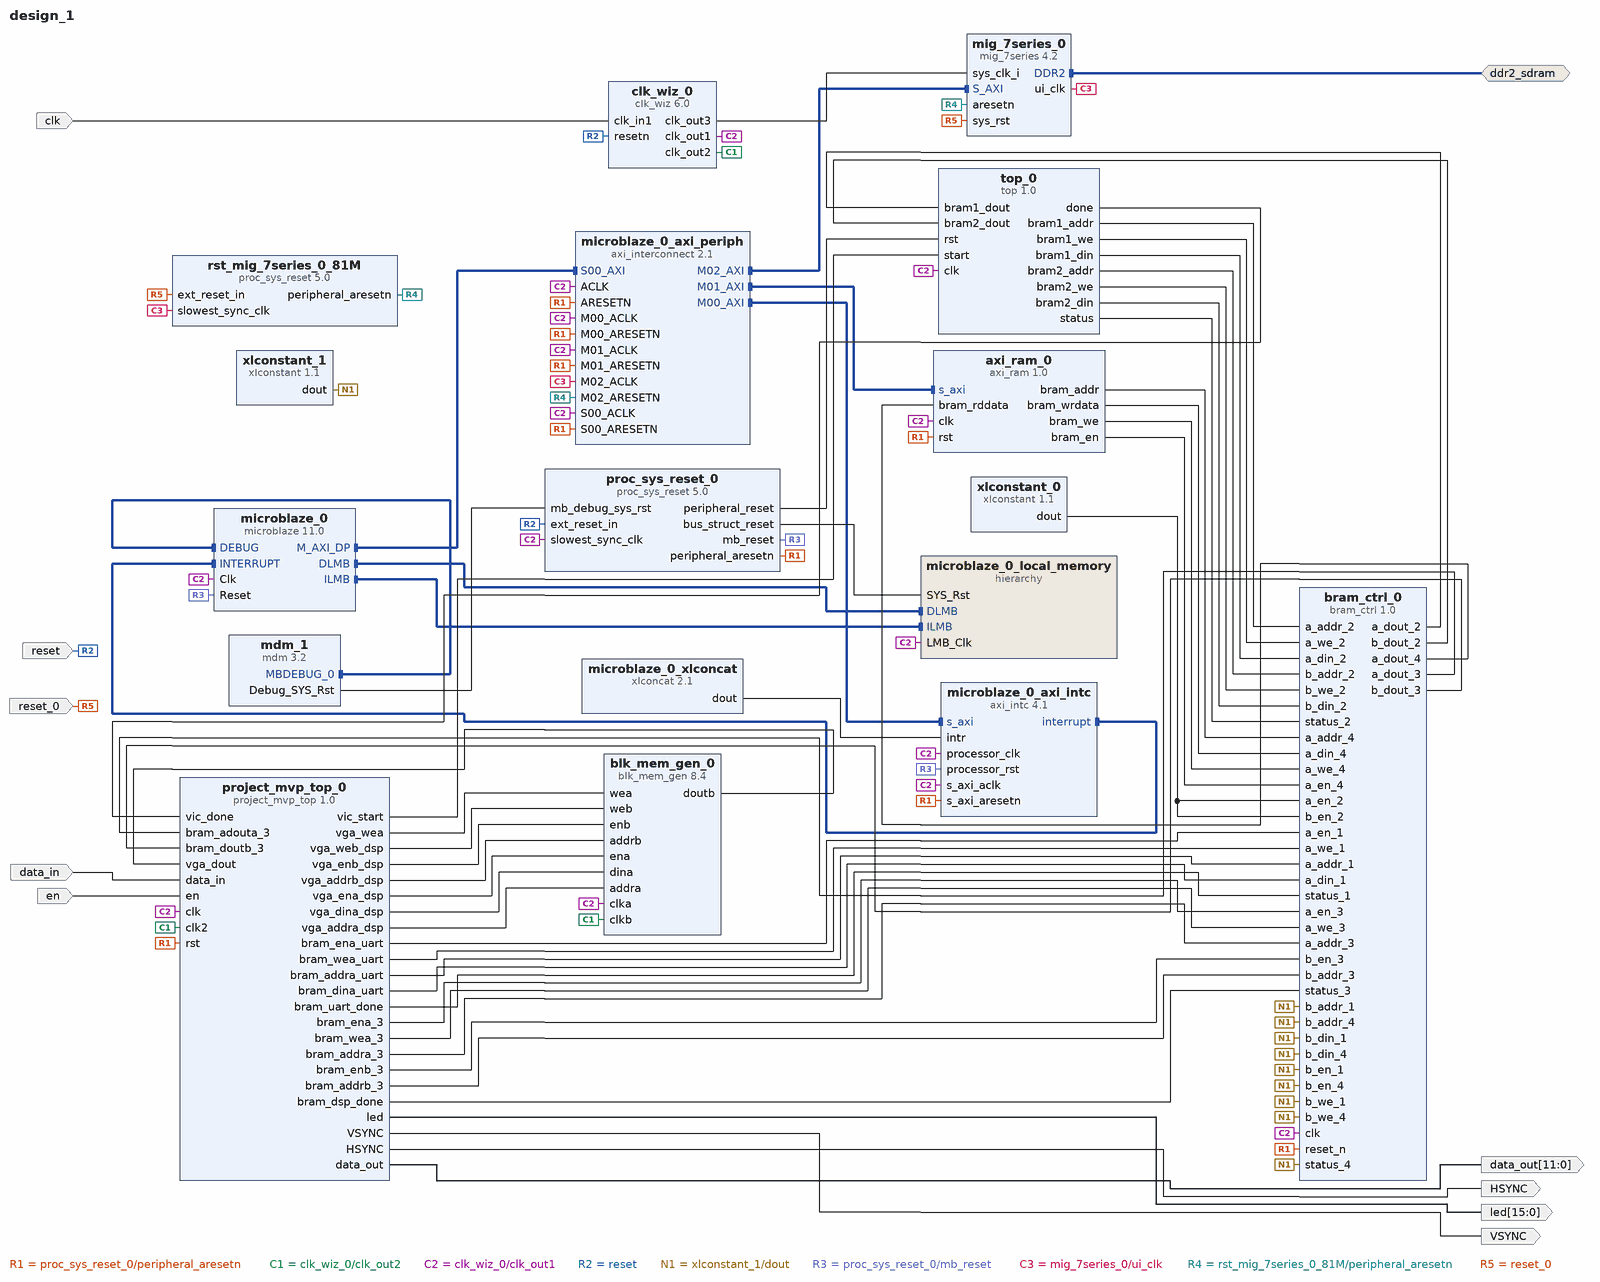
[diagram p0: block diagram of the top level]
# Vivado block design design_1, xc7a100tcsg324-1, Vivado 2018.3.1
create_bd_design design_1

create_bd_intf_port -mode Master -vlnv xilinx.com:interface:ddrx_rtl:1.0 ddr2_sdram
create_bd_port -dir I -type rst reset
set_property -dict {CONFIG.POLARITY ACTIVE_LOW} [get_bd_ports reset]
create_bd_port -dir I -type clk clk
set_property -dict {CONFIG.FREQ_HZ 100000000} [get_bd_ports clk]
create_bd_port -dir O -from 15 -to 0 led
create_bd_port -dir I data_in
create_bd_port -dir I en
create_bd_port -dir O VSYNC
create_bd_port -dir O HSYNC
create_bd_port -dir O -from 11 -to 0 data_out
create_bd_port -dir I -type rst reset_0
set_property -dict {CONFIG.POLARITY ACTIVE_LOW} [get_bd_ports reset_0]

create_bd_cell -type ip -vlnv xilinx.com:ip:blk_mem_gen:8.4 blk_mem_gen_0
set_property -dict [list \
  CONFIG.Enable_32bit_Address false \
  CONFIG.Enable_B Use_ENB_Pin \
  CONFIG.Memory_Type True_Dual_Port_RAM \
  CONFIG.Port_B_Clock 100 \
  CONFIG.Port_B_Enable_Rate 100 \
  CONFIG.Port_B_Write_Rate 50 \
  CONFIG.Read_Width_A 4 \
  CONFIG.Read_Width_B 4 \
  CONFIG.Register_PortA_Output_of_Memory_Primitives false \
  CONFIG.Register_PortB_Output_of_Memory_Primitives false \
  CONFIG.Use_Byte_Write_Enable false \
  CONFIG.Use_RSTA_Pin false \
  CONFIG.Use_RSTB_Pin false \
  CONFIG.Write_Depth_A 62500 \
  CONFIG.Write_Width_A 4 \
  CONFIG.Write_Width_B 4 \
  CONFIG.use_bram_block Stand_Alone \
] [get_bd_cells blk_mem_gen_0]
create_bd_cell -type ip -vlnv xilinx.com:ip:xlconstant:1.1 xlconstant_0
create_bd_cell -type ip -vlnv xilinx.com:ip:xlconstant:1.1 xlconstant_1
set_property -dict {CONFIG.CONST_VAL 0 CONFIG.CONST_WIDTH 16} [get_bd_cells xlconstant_1]
create_bd_cell -type ip -vlnv xilinx.com:user:bram_ctrl:1.0 bram_ctrl_0
create_bd_cell -type ip -vlnv xilinx.com:user:project_mvp_top:1.0 project_mvp_top_0
create_bd_cell -type ip -vlnv xilinx.com:user:top:1.0 top_0
set_property -dict {CONFIG.COLS 5 CONFIG.ROWS 5} [get_bd_cells top_0]
create_bd_cell -type ip -vlnv xilinx.com:ip:microblaze:11.0 microblaze_0
set_property -dict {CONFIG.C_DEBUG_ENABLED 1 CONFIG.C_D_AXI 1 CONFIG.C_D_LMB 1 CONFIG.C_I_LMB 1} [get_bd_cells microblaze_0]
create_bd_cell -type hier microblaze_0_local_memory
create_bd_cell -type ip -vlnv xilinx.com:ip:axi_interconnect:2.1 microblaze_0_axi_periph
set_property -dict {CONFIG.NUM_MI 3} [get_bd_cells microblaze_0_axi_periph]
create_bd_cell -type ip -vlnv xilinx.com:ip:axi_intc:4.1 microblaze_0_axi_intc
set_property -dict {CONFIG.C_HAS_FAST 1} [get_bd_cells microblaze_0_axi_intc]
create_bd_cell -type ip -vlnv xilinx.com:ip:xlconcat:2.1 microblaze_0_xlconcat
create_bd_cell -type ip -vlnv xilinx.com:ip:mdm:3.2 mdm_1
create_bd_cell -type ip -vlnv xilinx.com:user:axi_ram:1.0 axi_ram_0
create_bd_cell -type ip -vlnv xilinx.com:ip:clk_wiz:6.0 clk_wiz_0
set_property -dict [list \
  CONFIG.CLKIN2_JITTER_PS 166.66 \
  CONFIG.CLKOUT1_JITTER 151.636 \
  CONFIG.CLKOUT1_REQUESTED_OUT_FREQ 50 \
  CONFIG.CLKOUT2_JITTER 175.402 \
  CONFIG.CLKOUT2_PHASE_ERROR 98.575 \
  CONFIG.CLKOUT2_REQUESTED_OUT_FREQ 25.000 \
  CONFIG.CLKOUT2_USED true \
  CONFIG.CLKOUT3_JITTER 114.829 \
  CONFIG.CLKOUT3_PHASE_ERROR 98.575 \
  CONFIG.CLKOUT3_REQUESTED_OUT_FREQ 200.000 \
  CONFIG.CLKOUT3_USED true \
  CONFIG.MMCM_CLKIN2_PERIOD 10.000 \
  CONFIG.MMCM_CLKOUT0_DIVIDE_F 20.000 \
  CONFIG.MMCM_CLKOUT1_DIVIDE 40 \
  CONFIG.MMCM_CLKOUT2_DIVIDE 5 \
  CONFIG.MMCM_DIVCLK_DIVIDE 1 \
  CONFIG.NUM_OUT_CLKS 3 \
  CONFIG.RESET_PORT resetn \
  CONFIG.RESET_TYPE ACTIVE_LOW \
  CONFIG.SECONDARY_IN_FREQ 100.000 \
  CONFIG.SECONDARY_SOURCE Single_ended_clock_capable_pin \
  CONFIG.USE_INCLK_SWITCHOVER false \
] [get_bd_cells clk_wiz_0]
create_bd_cell -type ip -vlnv xilinx.com:ip:proc_sys_reset:5.0 proc_sys_reset_0
create_bd_cell -type ip -vlnv xilinx.com:ip:proc_sys_reset:5.0 rst_mig_7series_0_81M
set_property -dict {CONFIG.RESET_BOARD_INTERFACE reset CONFIG.USE_BOARD_FLOW true} [get_bd_cells rst_mig_7series_0_81M]
create_bd_cell -type ip -vlnv xilinx.com:ip:mig_7series:4.2 mig_7series_0
set_property -dict {CONFIG.RESET_BOARD_INTERFACE reset} [get_bd_cells mig_7series_0]

# ---- hierarchy /microblaze_0_local_memory ----
current_bd_instance /microblaze_0_local_memory
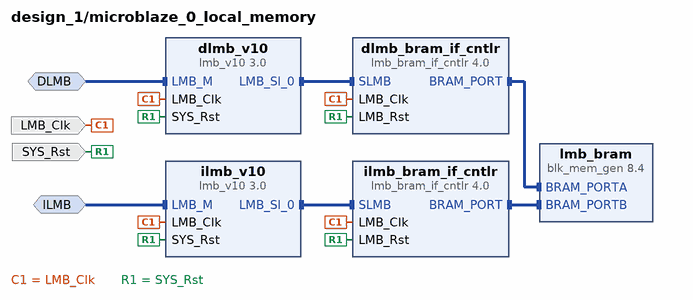
[diagram p1: block diagram inside /microblaze_0_local_memory]
create_bd_intf_pin -mode MirroredMaster -vlnv xilinx.com:interface:lmb_rtl:1.0 DLMB
create_bd_intf_pin -mode MirroredMaster -vlnv xilinx.com:interface:lmb_rtl:1.0 ILMB
create_bd_pin -dir I -type clk LMB_Clk
create_bd_pin -dir I -type rst SYS_Rst

create_bd_cell -type ip -vlnv xilinx.com:ip:lmb_v10:3.0 dlmb_v10
create_bd_cell -type ip -vlnv xilinx.com:ip:lmb_v10:3.0 ilmb_v10
create_bd_cell -type ip -vlnv xilinx.com:ip:lmb_bram_if_cntlr:4.0 dlmb_bram_if_cntlr
set_property -dict {CONFIG.C_ECC 0} [get_bd_cells dlmb_bram_if_cntlr]
create_bd_cell -type ip -vlnv xilinx.com:ip:lmb_bram_if_cntlr:4.0 ilmb_bram_if_cntlr
set_property -dict {CONFIG.C_ECC 0} [get_bd_cells ilmb_bram_if_cntlr]
create_bd_cell -type ip -vlnv xilinx.com:ip:blk_mem_gen:8.4 lmb_bram
set_property -dict {CONFIG.Memory_Type True_Dual_Port_RAM CONFIG.use_bram_block BRAM_Controller} [get_bd_cells lmb_bram]

# ---- connections ----

current_bd_instance /microblaze_0_local_memory
connect_bd_intf_net -intf_net microblaze_0_ilmb_bus [get_bd_intf_pins ilmb_v10/LMB_Sl_0] [get_bd_intf_pins ilmb_bram_if_cntlr/SLMB]
connect_bd_intf_net -intf_net microblaze_0_ilmb_cntlr [get_bd_intf_pins ilmb_bram_if_cntlr/BRAM_PORT] [get_bd_intf_pins lmb_bram/BRAM_PORTB]
connect_bd_intf_net -intf_net microblaze_0_dlmb [get_bd_intf_pins DLMB] [get_bd_intf_pins dlmb_v10/LMB_M]
connect_bd_intf_net -intf_net microblaze_0_dlmb_cntlr [get_bd_intf_pins dlmb_bram_if_cntlr/BRAM_PORT] [get_bd_intf_pins lmb_bram/BRAM_PORTA]
connect_bd_intf_net -intf_net microblaze_0_ilmb [get_bd_intf_pins ILMB] [get_bd_intf_pins ilmb_v10/LMB_M]
connect_bd_intf_net -intf_net microblaze_0_dlmb_bus [get_bd_intf_pins dlmb_v10/LMB_Sl_0] [get_bd_intf_pins dlmb_bram_if_cntlr/SLMB]
connect_bd_net -net microblaze_0_Clk [get_bd_pins LMB_Clk] \
  [get_bd_pins dlmb_v10/LMB_Clk] [get_bd_pins dlmb_bram_if_cntlr/LMB_Clk] [get_bd_pins ilmb_v10/LMB_Clk] \
  [get_bd_pins ilmb_bram_if_cntlr/LMB_Clk]
connect_bd_net [get_bd_pins SYS_Rst] \
  [get_bd_pins dlmb_v10/SYS_Rst] [get_bd_pins dlmb_bram_if_cntlr/LMB_Rst] [get_bd_pins ilmb_v10/SYS_Rst] \
  [get_bd_pins ilmb_bram_if_cntlr/LMB_Rst]
set_property HDL_ATTRIBUTE.BMM_INFO_ADDRESS_SPACE {byte  0x00000000 32 > design_1 microblaze_0_local_memory/lmb_bram} [get_bd_cells dlmb_bram_if_cntlr]
set_property HDL_ATTRIBUTE.KEEP_HIERARCHY yes [get_bd_cells dlmb_bram_if_cntlr]

current_bd_instance /
connect_bd_intf_net -intf_net microblaze_0_axi_dp [get_bd_intf_pins microblaze_0_axi_periph/S00_AXI] [get_bd_intf_pins microblaze_0/M_AXI_DP]
connect_bd_intf_net [get_bd_intf_pins microblaze_0/DLMB] [get_bd_intf_pins microblaze_0_local_memory/DLMB]
connect_bd_intf_net [get_bd_intf_pins microblaze_0/ILMB] [get_bd_intf_pins microblaze_0_local_memory/ILMB]
connect_bd_intf_net [get_bd_intf_pins mdm_1/MBDEBUG_0] [get_bd_intf_pins microblaze_0/DEBUG]
connect_bd_intf_net -intf_net microblaze_0_intc_axi [get_bd_intf_pins microblaze_0_axi_periph/M00_AXI] [get_bd_intf_pins microblaze_0_axi_intc/s_axi]
connect_bd_intf_net [get_bd_intf_pins microblaze_0_axi_intc/interrupt] [get_bd_intf_pins microblaze_0/INTERRUPT]
connect_bd_intf_net [get_bd_intf_pins microblaze_0_axi_periph/M01_AXI] [get_bd_intf_pins axi_ram_0/s_axi]
connect_bd_intf_net [get_bd_intf_ports ddr2_sdram] [get_bd_intf_pins mig_7series_0/DDR2]
connect_bd_intf_net [get_bd_intf_pins microblaze_0_axi_periph/M02_AXI] [get_bd_intf_pins mig_7series_0/S_AXI]
connect_bd_net -net clk_100MHz_1 [get_bd_ports clk] [get_bd_pins clk_wiz_0/clk_in1]
connect_bd_net [get_bd_pins project_mvp_top_0/bram_ena_uart] [get_bd_pins bram_ctrl_0/a_en_1]
connect_bd_net [get_bd_pins project_mvp_top_0/bram_wea_uart] [get_bd_pins bram_ctrl_0/a_we_1]
connect_bd_net [get_bd_pins project_mvp_top_0/bram_addra_uart] [get_bd_pins bram_ctrl_0/a_addr_1]
connect_bd_net [get_bd_pins project_mvp_top_0/bram_dina_uart] [get_bd_pins bram_ctrl_0/a_din_1]
connect_bd_net [get_bd_pins project_mvp_top_0/led] [get_bd_ports led]
connect_bd_net -net data_in_0_1 [get_bd_ports data_in] [get_bd_pins project_mvp_top_0/data_in]
connect_bd_net [get_bd_pins proc_sys_reset_0/peripheral_aresetn] \
  [get_bd_pins bram_ctrl_0/reset_n] [get_bd_pins project_mvp_top_0/rst] [get_bd_pins microblaze_0_axi_periph/ARESETN] \
  [get_bd_pins microblaze_0_axi_periph/S00_ARESETN] [get_bd_pins microblaze_0_axi_periph/M00_ARESETN] \
  [get_bd_pins microblaze_0_axi_intc/s_axi_aresetn] [get_bd_pins microblaze_0_axi_periph/M01_ARESETN] \
  [get_bd_pins axi_ram_0/rst]
connect_bd_net -net en_0_1 [get_bd_ports en] [get_bd_pins project_mvp_top_0/en]
connect_bd_net [get_bd_pins project_mvp_top_0/VSYNC] [get_bd_ports VSYNC]
connect_bd_net [get_bd_pins project_mvp_top_0/HSYNC] [get_bd_ports HSYNC]
connect_bd_net [get_bd_pins project_mvp_top_0/data_out] [get_bd_ports data_out]
connect_bd_net [get_bd_pins clk_wiz_0/clk_out2] [get_bd_pins blk_mem_gen_0/clkb] [get_bd_pins project_mvp_top_0/clk2]
connect_bd_net -net microblaze_0_Clk [get_bd_pins clk_wiz_0/clk_out1] \
  [get_bd_pins blk_mem_gen_0/clka] [get_bd_pins bram_ctrl_0/clk] [get_bd_pins project_mvp_top_0/clk] [get_bd_pins top_0/clk] \
  [get_bd_pins microblaze_0/Clk] [get_bd_pins microblaze_0_axi_periph/ACLK] [get_bd_pins microblaze_0_axi_periph/S00_ACLK] \
  [get_bd_pins microblaze_0_axi_periph/M00_ACLK] [get_bd_pins microblaze_0_axi_intc/s_axi_aclk] \
  [get_bd_pins microblaze_0_axi_intc/processor_clk] [get_bd_pins microblaze_0_local_memory/LMB_Clk] \
  [get_bd_pins microblaze_0_axi_periph/M01_ACLK] [get_bd_pins axi_ram_0/clk] [get_bd_pins proc_sys_reset_0/slowest_sync_clk]
connect_bd_net [get_bd_pins project_mvp_top_0/bram_uart_done] [get_bd_pins bram_ctrl_0/status_1]
connect_bd_net [get_bd_pins bram_ctrl_0/a_dout_2] [get_bd_pins top_0/bram1_dout]
connect_bd_net [get_bd_pins bram_ctrl_0/b_dout_2] [get_bd_pins top_0/bram2_dout]
connect_bd_net [get_bd_pins top_0/bram1_addr] [get_bd_pins bram_ctrl_0/a_addr_2]
connect_bd_net [get_bd_pins top_0/bram1_we] [get_bd_pins bram_ctrl_0/a_we_2]
connect_bd_net [get_bd_pins top_0/bram1_din] [get_bd_pins bram_ctrl_0/a_din_2]
connect_bd_net [get_bd_pins top_0/bram2_addr] [get_bd_pins bram_ctrl_0/b_addr_2]
connect_bd_net [get_bd_pins top_0/bram2_we] [get_bd_pins bram_ctrl_0/b_we_2]
connect_bd_net [get_bd_pins top_0/bram2_din] [get_bd_pins bram_ctrl_0/b_din_2]
connect_bd_net [get_bd_pins top_0/status] [get_bd_pins bram_ctrl_0/status_2]
connect_bd_net [get_bd_pins top_0/done] [get_bd_pins project_mvp_top_0/vic_done]
connect_bd_net [get_bd_pins project_mvp_top_0/vic_start] [get_bd_pins top_0/start]
connect_bd_net [get_bd_ports reset] [get_bd_pins clk_wiz_0/resetn] [get_bd_pins proc_sys_reset_0/ext_reset_in]
connect_bd_net [get_bd_pins proc_sys_reset_0/peripheral_reset] [get_bd_pins top_0/rst]
connect_bd_net [get_bd_pins xlconstant_1/dout] \
  [get_bd_pins bram_ctrl_0/status_4] [get_bd_pins bram_ctrl_0/b_din_4] [get_bd_pins bram_ctrl_0/b_addr_4] \
  [get_bd_pins bram_ctrl_0/b_we_4] [get_bd_pins bram_ctrl_0/b_en_4] [get_bd_pins bram_ctrl_0/b_din_1] \
  [get_bd_pins bram_ctrl_0/b_we_1] [get_bd_pins bram_ctrl_0/b_addr_1] [get_bd_pins bram_ctrl_0/b_en_1]
connect_bd_net [get_bd_pins project_mvp_top_0/bram_ena_3] [get_bd_pins bram_ctrl_0/a_en_3]
connect_bd_net [get_bd_pins project_mvp_top_0/bram_wea_3] [get_bd_pins bram_ctrl_0/a_we_3]
connect_bd_net [get_bd_pins project_mvp_top_0/bram_addra_3] [get_bd_pins bram_ctrl_0/a_addr_3]
connect_bd_net [get_bd_pins project_mvp_top_0/bram_enb_3] [get_bd_pins bram_ctrl_0/b_en_3]
connect_bd_net [get_bd_pins project_mvp_top_0/bram_addrb_3] [get_bd_pins bram_ctrl_0/b_addr_3]
connect_bd_net [get_bd_pins bram_ctrl_0/a_dout_3] [get_bd_pins project_mvp_top_0/bram_adouta_3]
connect_bd_net [get_bd_pins bram_ctrl_0/b_dout_3] [get_bd_pins project_mvp_top_0/bram_doutb_3]
connect_bd_net [get_bd_pins project_mvp_top_0/vga_wea] [get_bd_pins blk_mem_gen_0/wea]
connect_bd_net [get_bd_pins project_mvp_top_0/vga_web_dsp] [get_bd_pins blk_mem_gen_0/web]
connect_bd_net [get_bd_pins project_mvp_top_0/vga_enb_dsp] [get_bd_pins blk_mem_gen_0/enb]
connect_bd_net [get_bd_pins blk_mem_gen_0/doutb] [get_bd_pins project_mvp_top_0/vga_dout]
connect_bd_net [get_bd_pins project_mvp_top_0/vga_addrb_dsp] [get_bd_pins blk_mem_gen_0/addrb]
connect_bd_net [get_bd_pins project_mvp_top_0/vga_ena_dsp] [get_bd_pins blk_mem_gen_0/ena]
connect_bd_net [get_bd_pins project_mvp_top_0/vga_dina_dsp] [get_bd_pins blk_mem_gen_0/dina]
connect_bd_net [get_bd_pins project_mvp_top_0/vga_addra_dsp] [get_bd_pins blk_mem_gen_0/addra]
connect_bd_net [get_bd_pins project_mvp_top_0/bram_dsp_done] [get_bd_pins bram_ctrl_0/status_3]
connect_bd_net [get_bd_pins xlconstant_0/dout] [get_bd_pins bram_ctrl_0/b_en_2] [get_bd_pins bram_ctrl_0/a_en_2]
connect_bd_net -net microblaze_0_intr [get_bd_pins microblaze_0_xlconcat/dout] [get_bd_pins microblaze_0_axi_intc/intr]
connect_bd_net [get_bd_pins proc_sys_reset_0/mb_reset] [get_bd_pins microblaze_0/Reset] [get_bd_pins microblaze_0_axi_intc/processor_rst]
connect_bd_net [get_bd_pins proc_sys_reset_0/bus_struct_reset] [get_bd_pins microblaze_0_local_memory/SYS_Rst]
connect_bd_net [get_bd_pins mdm_1/Debug_SYS_Rst] [get_bd_pins proc_sys_reset_0/mb_debug_sys_rst]
connect_bd_net [get_bd_pins bram_ctrl_0/a_dout_4] [get_bd_pins axi_ram_0/bram_rddata]
connect_bd_net [get_bd_pins axi_ram_0/bram_addr] [get_bd_pins bram_ctrl_0/a_addr_4]
connect_bd_net [get_bd_pins axi_ram_0/bram_wrdata] [get_bd_pins bram_ctrl_0/a_din_4]
connect_bd_net [get_bd_pins axi_ram_0/bram_we] [get_bd_pins bram_ctrl_0/a_we_4]
connect_bd_net [get_bd_pins axi_ram_0/bram_en] [get_bd_pins bram_ctrl_0/a_en_4]
connect_bd_net [get_bd_pins mig_7series_0/ui_clk] [get_bd_pins microblaze_0_axi_periph/M02_ACLK] [get_bd_pins rst_mig_7series_0_81M/slowest_sync_clk]
connect_bd_net [get_bd_pins rst_mig_7series_0_81M/peripheral_aresetn] \
  [get_bd_pins microblaze_0_axi_periph/M02_ARESETN] [get_bd_pins mig_7series_0/aresetn]
connect_bd_net [get_bd_pins clk_wiz_0/clk_out3] [get_bd_pins mig_7series_0/sys_clk_i]
connect_bd_net -net reset_0_1 [get_bd_ports reset_0] [get_bd_pins rst_mig_7series_0_81M/ext_reset_in] [get_bd_pins mig_7series_0/sys_rst]
set_property HDL_ATTRIBUTE.BMM_INFO_PROCESSOR {microblaze-le > design_1 microblaze_0_local_memory/dlmb_bram_if_cntlr} [get_bd_cells microblaze_0]
set_property HDL_ATTRIBUTE.KEEP_HIERARCHY yes [get_bd_cells microblaze_0]

# ---- address map ----
assign_bd_address -offset 0x00000000 -range 32K -target_address_space [get_bd_addr_spaces microblaze_0/Data] [get_bd_addr_segs microblaze_0_local_memory/dlmb_bram_if_cntlr/SLMB/Mem]
assign_bd_address -offset 0x41200000 -range 64K -target_address_space [get_bd_addr_spaces microblaze_0/Data] [get_bd_addr_segs microblaze_0_axi_intc/S_AXI/Reg]
assign_bd_address -offset 0x44A00000 -range 64K -target_address_space [get_bd_addr_spaces microblaze_0/Data] [get_bd_addr_segs axi_ram_0/s_axi/reg0]
assign_bd_address -offset 0x80000000 -range 128M -target_address_space [get_bd_addr_spaces microblaze_0/Data] [get_bd_addr_segs mig_7series_0/memmap/memaddr]
assign_bd_address -offset 0x00000000 -range 32K -target_address_space [get_bd_addr_spaces microblaze_0/Instruction] [get_bd_addr_segs microblaze_0_local_memory/ilmb_bram_if_cntlr/SLMB/Mem]

validate_bd_design
save_bd_design
